# Altium schematic sheet BrauV2_IOController.SchDoc
size 420 x 297 mm; DocumentNumber: 12; SheetNumber: 12; SheetTotal: 22
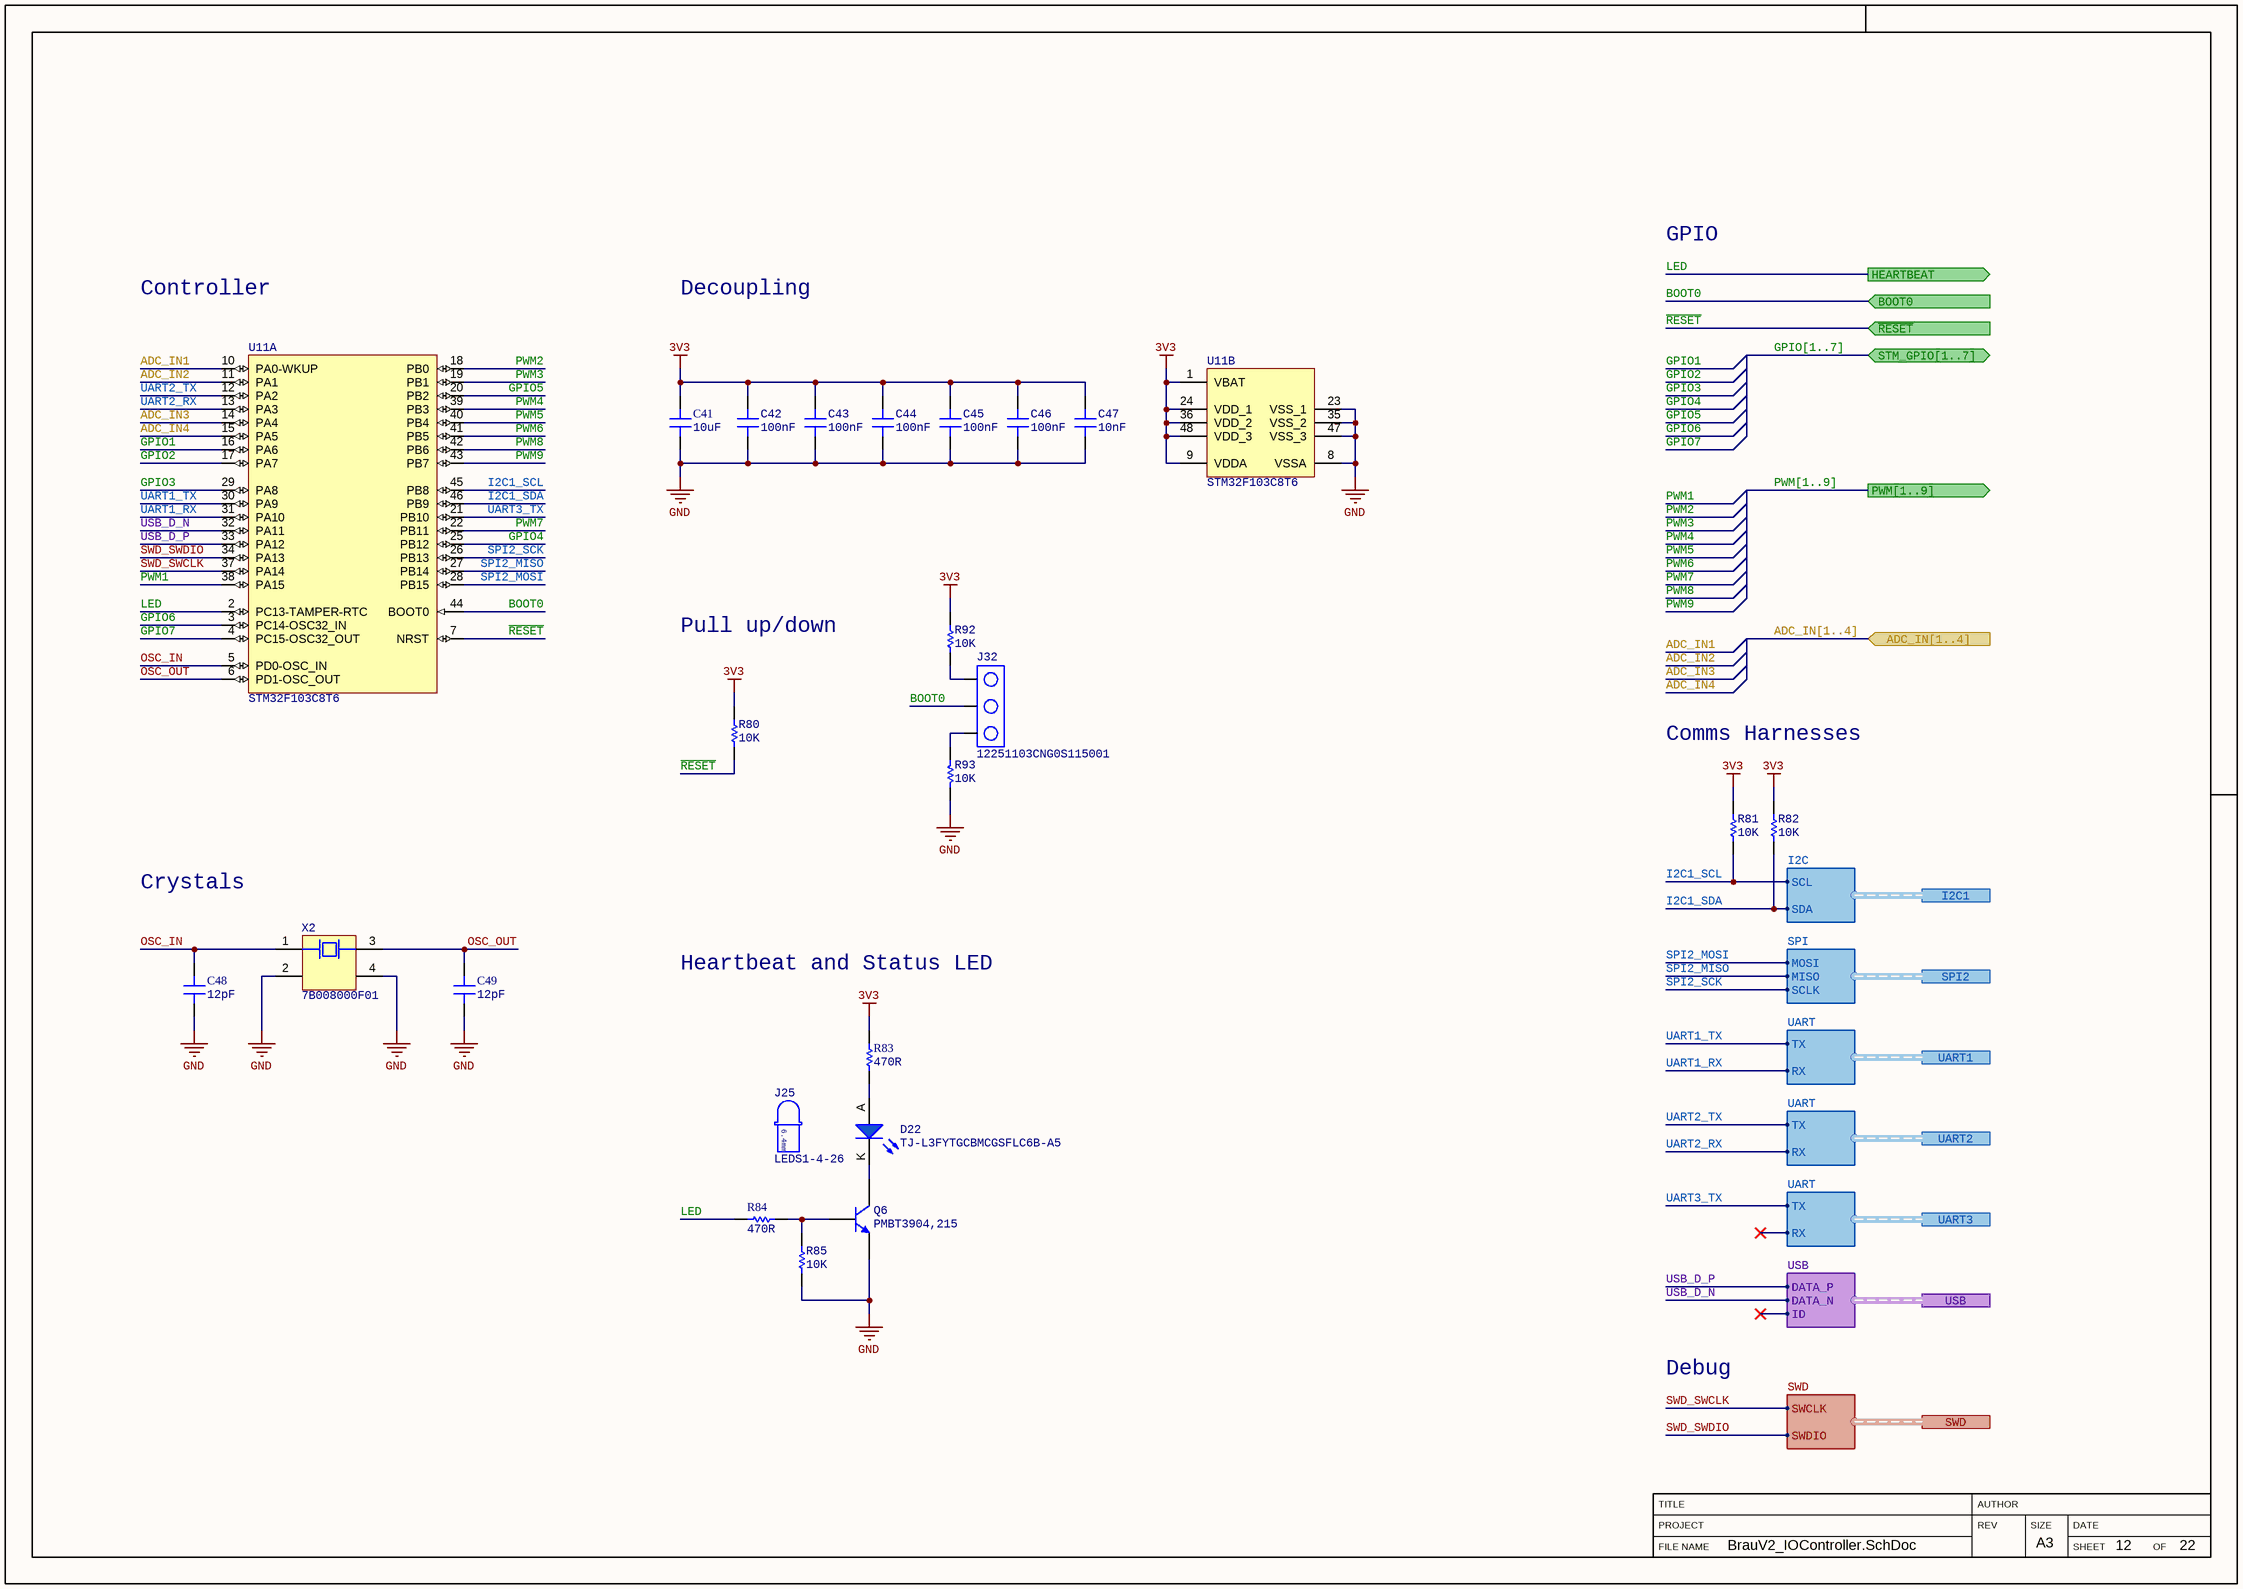
[diagram p0: BrauV2_IOController.SchDoc]

## Parts
C41  Capacitance: 10uF  [SMD_CAP_1206(3216)_N]  (hidden comment: CC1206KKX5R9BB106)
C42  Capacitance: 100nF  [SMD_CAP_0402(1005)_N]  (hidden comment: CC0402KRX5R6BB104)
C43  Capacitance: 100nF  [SMD_CAP_0402(1005)_N]  (hidden comment: CC0402KRX5R6BB104)
C44  Capacitance: 100nF  [SMD_CAP_0402(1005)_N]  (hidden comment: CC0402KRX5R6BB104)
C45  Capacitance: 100nF  [SMD_CAP_0402(1005)_N]  (hidden comment: CC0402KRX5R6BB104)
C46  Capacitance: 100nF  [SMD_CAP_0402(1005)_N]  (hidden comment: CC0402KRX5R6BB104)
C47  Capacitance: 10nF  [SMD_CAP_0402(1005)_N]  (hidden comment: CC0402KRX7R9BB103)
C48  Capacitance: 12pF  [SMD_CAP_0402(1005)_N]  (hidden comment: CC0402JRNPO9BN120)
C49  Capacitance: 12pF  [SMD_CAP_0402(1005)_N]  (hidden comment: CC0402JRNPO9BN120)
D22  TJ-L3FYTGCBMCGSFLC6B-A5  [LED_3MM_SPACED_6.4MM_BLUE]
J25  LEDS1-4-26  [3MM_LED_SPACER_6.4MM]
J32  12251103CNG0S115001  [Header_3POS]
Q6  PMBT3904,215  [SOT23-3]
R80  Resistance: 10K  [SMD_RES_0402(1005)_N]  (hidden comment: RC0402FR-0710KL)
R81  Resistance: 10K  [SMD_RES_0402(1005)_N]  (hidden comment: RC0402FR-0710KL)
R82  Resistance: 10K  [SMD_RES_0402(1005)_N]  (hidden comment: RC0402FR-0710KL)
R83  Resistance: 470R  [SMD_RES_0402(1005)_N]  (hidden comment: RC0402FR-07470RL)
R84  Resistance: 470R  [SMD_RES_0402(1005)_N]  (hidden comment: RC0402FR-07470RL)
R85  Resistance: 10K  [SMD_RES_0402(1005)_N]  (hidden comment: RC0402FR-0710KL)
R92  Resistance: 10K  [SMD_RES_0402(1005)_N]  (hidden comment: RC0402FR-0710KL)
R93  Resistance: 10K  [SMD_RES_0402(1005)_N]  (hidden comment: RC0402FR-0710KL)
U11  STM32F103C8T6  [LQFP32_7x7]  (parts A,B of 2)
X2  7B008000F01  [CRYSTAL_3225]

## Ports
ADC_IN[1..4] (in), BOOT0 (in), HEARTBEAT (out), I2C1 (harness I2C), PWM[1..9] (out), SPI2 (harness SPI), STM_GPIO[1..7] (bidir), SWD (harness SWD), UART1 (harness UART), UART2 (harness UART), UART3 (harness UART), USB (harness USB), ~{RESET} (in)

## Harnesses
I2C: SCL, SDA
SWD: SWCLK, SWDIO
UART: TX, RX
SPI: MOSI, MISO, SCLK
USB: DATA_P, DATA_N, ID

## Nets
3V3: C41.2 C42.2 C43.2 C44.2 C45.2 C46.2 C47.2 R80.2 R81.2 R82.2 R83.1 R92.2 U11.1(VBAT) U11.9(VDDA) U11.24(VDD_1) U11.36(VDD_2) U11.48(VDD_3)
GND: C41.1 C42.1 C43.1 C44.1 C45.1 C46.1 C47.1 C48.1 C49.1 Q6.2(E) R85.1 R93.2 U11.8(VSSA) U11.23(VSS_1) U11.35(VSS_2) U11.47(VSS_3) X2.2 X2.4
ADC_IN1: U11.10(PA0-WKUP)
ADC_IN2: U11.11(PA1)
ADC_IN3: U11.14(PA4)
ADC_IN4: U11.15(PA5)
BOOT0: J32.2 U11.44(BOOT0) ; port BOOT0
GPIO1: U11.16(PA6)
GPIO2: U11.17(PA7)
GPIO3: U11.29(PA8)
GPIO4: U11.25(PB12)
GPIO5: U11.20(PB2)
GPIO6: U11.3(PC14-OSC32_IN)
GPIO7: U11.4(PC15-OSC32_OUT)
I2C1_SCL: R81.1 U11.45(PB8) ; port I2C1.SCL
I2C1_SDA: R82.1 U11.46(PB9) ; port I2C1.SDA
LED: R84.2 U11.2(PC13-TAMPER-RTC) ; port HEARTBEAT
OSC_IN: C48.2 U11.5(PD0-OSC_IN) X2.1
OSC_OUT: C49.2 U11.6(PD1-OSC_OUT) X2.3
PWM1: U11.38(PA15)
PWM2: U11.18(PB0)
PWM3: U11.19(PB1)
PWM4: U11.39(PB3)
PWM5: U11.40(PB4)
PWM6: U11.41(PB5)
PWM7: U11.22(PB11)
PWM8: U11.42(PB6)
PWM9: U11.43(PB7)
~{RESET}: R80.1 U11.7(NRST) ; port ~{RESET}
SPI2_MISO: U11.27(PB14) ; port SPI2.MISO
SPI2_MOSI: U11.28(PB15) ; port SPI2.MOSI
SPI2_SCK: U11.26(PB13) ; port SPI2.SCLK
SWD_SWCLK: U11.37(PA14) ; port SWD.SWCLK
SWD_SWDIO: U11.34(PA13) ; port SWD.SWDIO
UART1_RX: U11.31(PA10) ; port UART1.RX
UART1_TX: U11.30(PA9) ; port UART1.TX
UART2_RX: U11.13(PA3) ; port UART2.RX
UART2_TX: U11.12(PA2) ; port UART2.TX
UART3_TX: U11.21(PB10) ; port UART3.TX
USB_D_N: U11.32(PA11) ; port USB.DATA_N
USB_D_P: U11.33(PA12) ; port USB.DATA_P
NetD22_A: D22.A R83.2
NetD22_K: D22.K Q6.3(C)
NetJ32_1: J32.1 R92.1
NetJ32_3: J32.3 R93.1
NetQ6_1: Q6.1(B) R84.1 R85.2

## Buses and harness runs
bus ADC_IN[1..4] = port ADC_IN[1..4]
bus GPIO[1..7] = port STM_GPIO[1..7]
bus PWM[1..9] = port PWM[1..9]

## Notes on the sheet
- GPIO
- Controller
- Decoupling
- Pull up/down
- Comms Harnesses
- Crystals
- Heartbeat and Status LED
- Debug
- FILE NAME
- PROJECT
- TITLE
- REV
- AUTHOR
- SIZE
- SHEET
- DATE
- OF
- A3
- (in symbol LEDS1-4-26) 6.4mm

## Library data of the parts
C41 = 10uF 1206 50V 10%: 10uF ±10% 50V X5R 1206 Multilayer Ceramic Capacitors MLCC - SMD/SMT RoHS; Package: 1206; Tolerance: 10%; Voltage Rating: 50V
C42-C46 = 100nF 0402 10V 10%: 100nF ±10% 10V X5R 0402 Multilayer Ceramic Capacitors MLCC - SMD/SMT RoHS; Package: 0402; Tolerance: 10%; Voltage Rating: 10V
C47 = 10nF 0402 50V 10%: 10nF ±10% 50V X7R 0402 Multilayer Ceramic Capacitors MLCC - SMD/SMT RoHS; Package: 0402; Tolerance: 10%; Voltage Rating: 50V
C48 C49 = 12pF 0402 50V 5%: 12pF ±5% 50V NP0 0402 Multilayer Ceramic Capacitors MLCC - SMD/SMT RoHS; Package: 0402; Tolerance: 5%; Voltage Rating: 50V
D22 = TJ-L3FYTGCBMCGSFLC6B-A5: LED 3mm Blue 460nm~470nm 2.7V~3.6V Through Hole Light Emitting Diodes (LED) RoHS C330760
J25 = LEDS1-4-26: 3mm LED spacer 6.4mm height
J32 = 3-way Jumper: Pin Header 3 1 right-angle，180degrees 2.54mm Through Hole,P=2.54mm Pin Header & Female Header RoHS
Q6 = PMBT3904,215: NPN 200mA 40V 250mW SOT-23(SOT-23-3) Transistors (NPN/PNP) RoHS
R80-R82 R85 R92 R93 = 10K 0402 1% 1/16W: 10kΩ ±1% 1/16W ±100ppm/℃ 0402 Chip Resistor - Surface Mount RoHS; Package: 0402; Tolerance: 1%; Power Rating: 1/16W
R83 R84 = 470R 0402 1% 1W: 470Ω ±1% 1/16W ±100ppm/℃ 0402 Chip Resistor - Surface Mount RoHS; Power Rating: 1W; Package: 0402; Tolerance: 1%
U11 = STM32F103C8T6: Mainstream Performance line, Arm Cortex-M3 MCU with 64 Kbytes of Flash memory, 72 MHz CPU, motor control, USB and CAN
X2 = 7B008000F01: 8MHz ±10ppm 8pF 200Ω SMD-3225_4P SMD Crystal Resonators RoHS